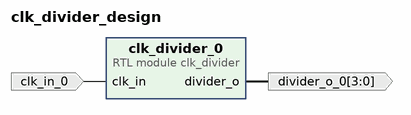
[diagram p0: block diagram of the top level]
# Vivado block design clk_divider_design, xc7z007sclg225-1, Vivado 2018.2
create_bd_design clk_divider_design

create_bd_port -dir I clk_in_0
create_bd_port -dir O -from 3 -to 0 divider_o_0

create_bd_cell -type module -reference clk_divider clk_divider_0

# ---- connections ----

connect_bd_net -net clk_in_0_1 [get_bd_ports clk_in_0] [get_bd_pins clk_divider_0/clk_in]
connect_bd_net [get_bd_pins clk_divider_0/divider_o] [get_bd_ports divider_o_0]

validate_bd_design
save_bd_design
